# EasyEDA Pro project ProProject_【核心板】STC89C52RC最小系统_2024-04-21.epro, schematic Schematic1
Create Date: 2024-04-10; Page Name: P1; Project Name: 【核心板】STC89C52RC最小系统; Schematic Name: Schematic1; Update Date: 2024-04-20
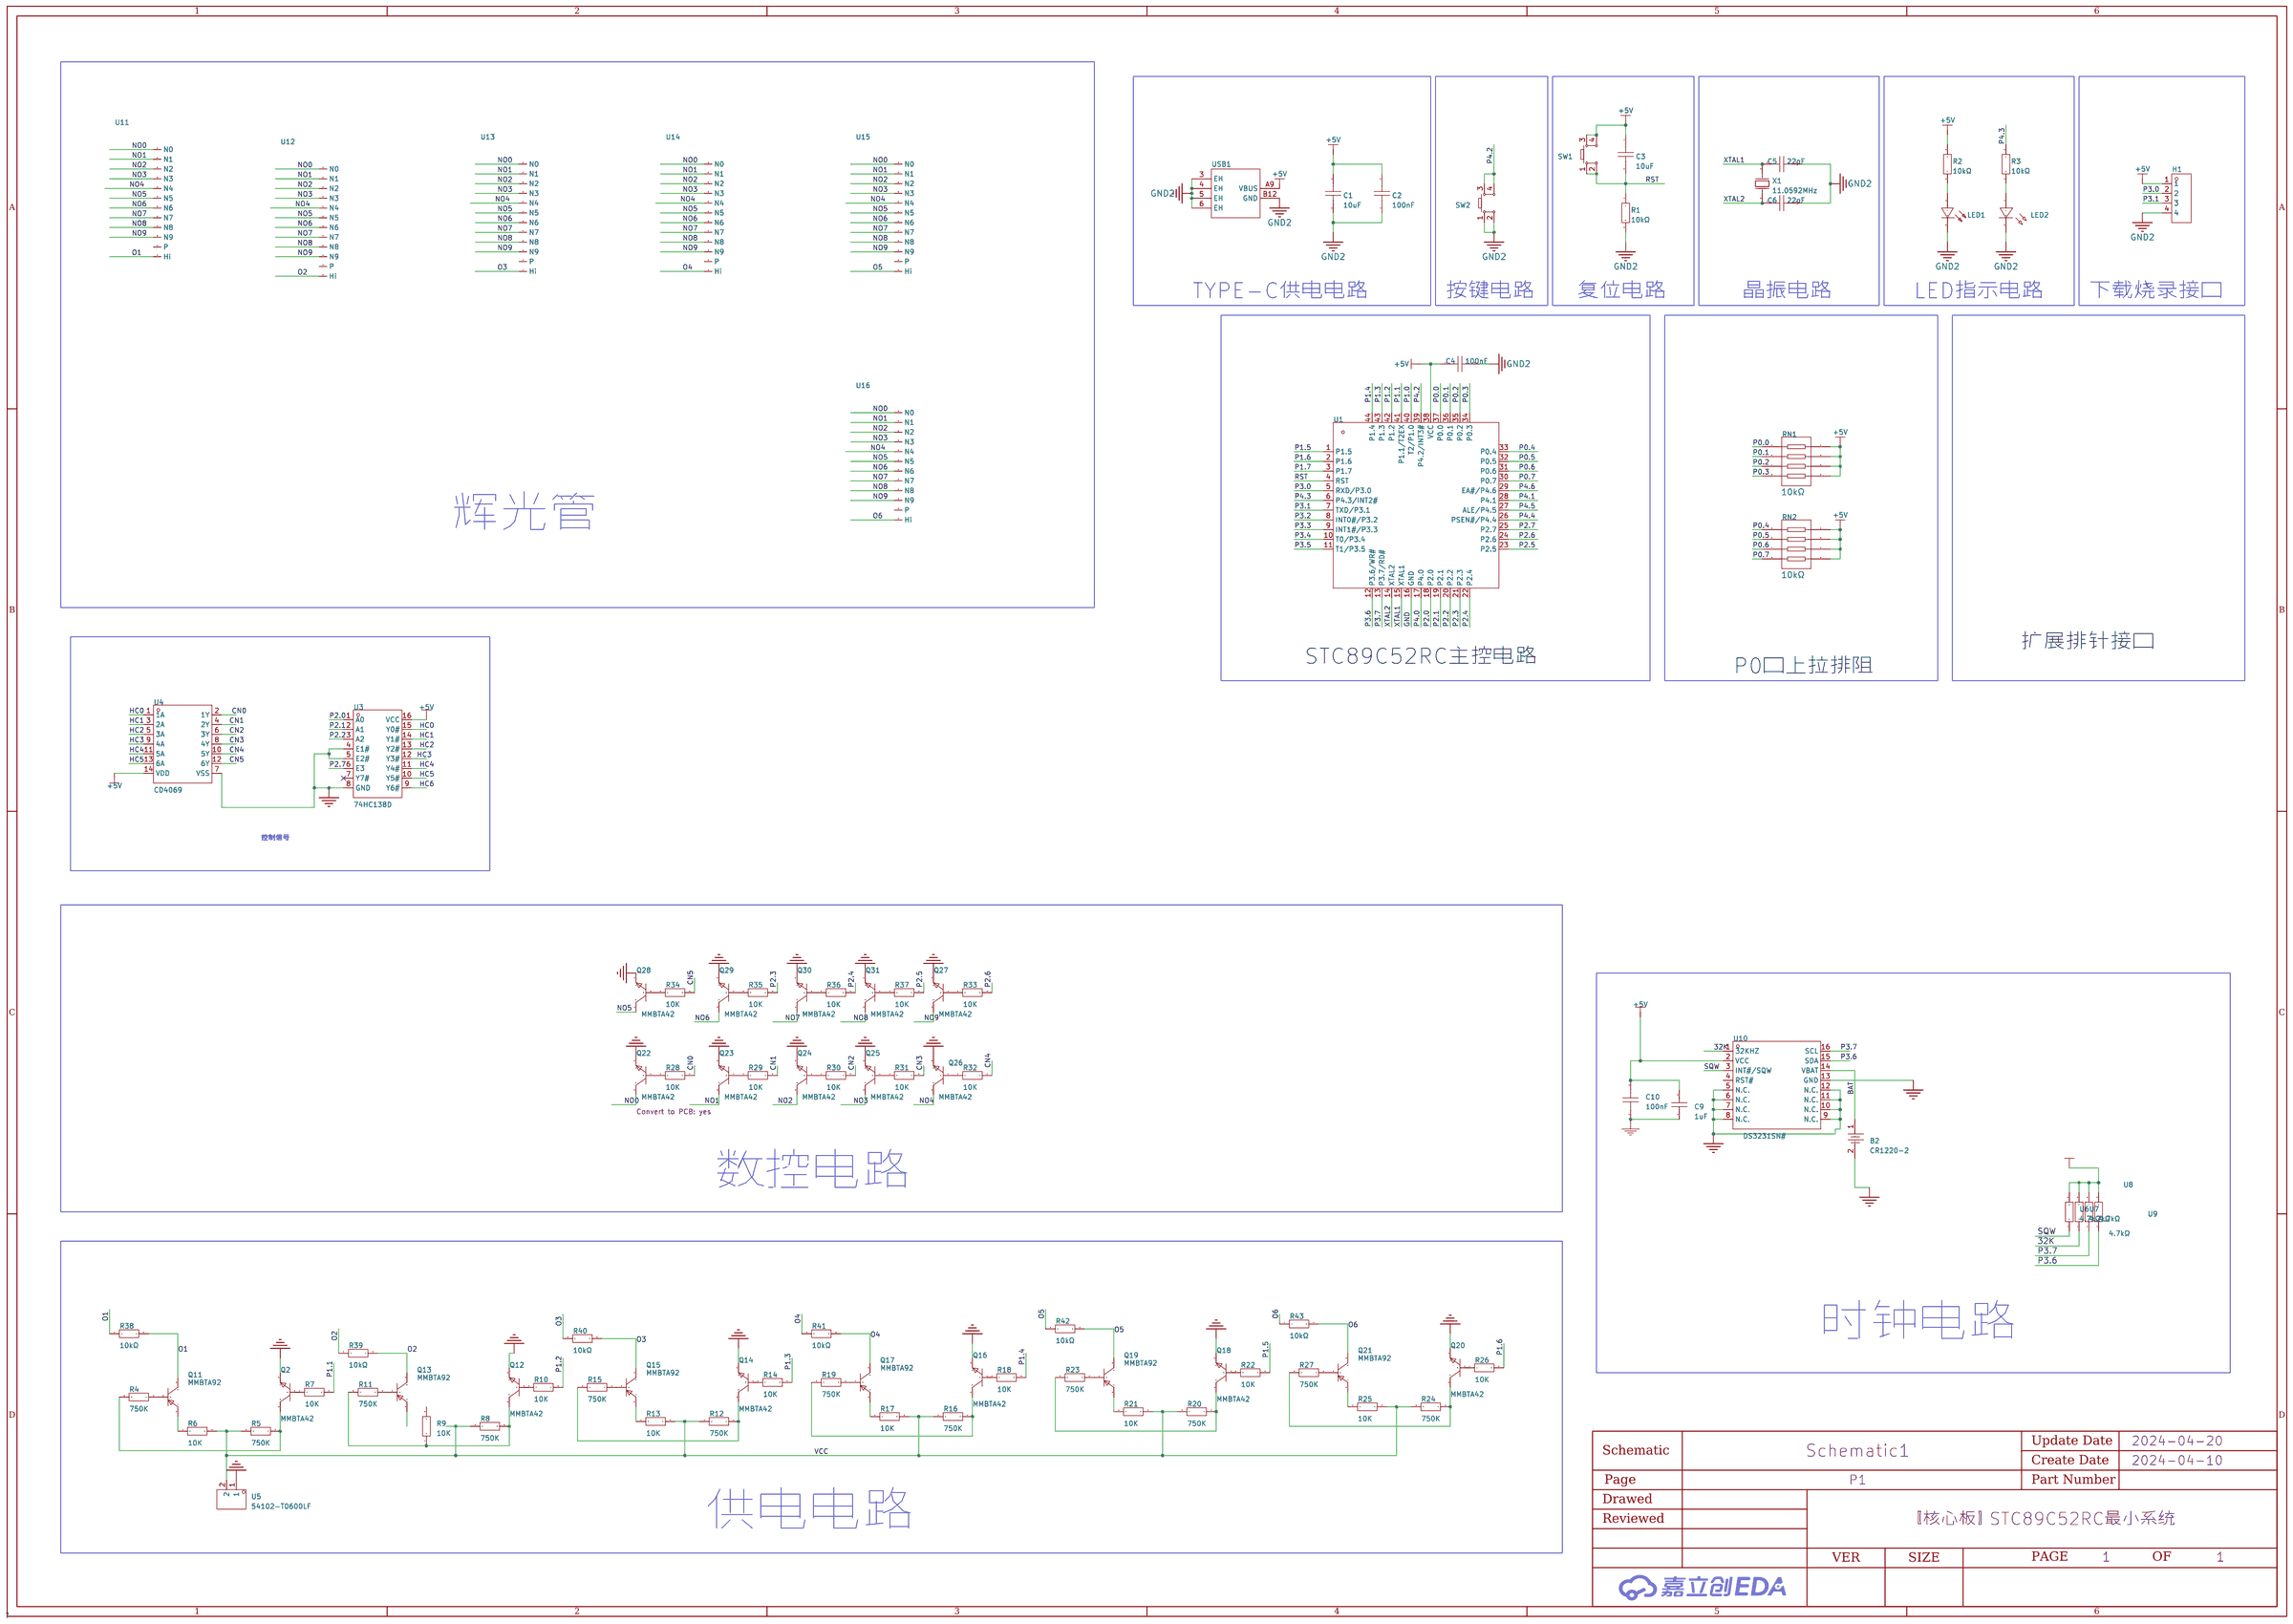
[diagram p0: schematic sheet]

## Parts
B2  CR1220-2  [BAT-SMD_CR1220-2]
C1  10uF  [C0603]
C2  100nF  [C0603]
C3  10uF  [C0603]
C4  100nF  [C0603]
C5  22pF  [C0603]
C6  22pF  [C0603]
C9  1uF  [C0603]
C10  100nF  [C0603]
H1  DZ254W-11-04-65  [HDR-TH_4P-P2.54-H-M-W10.3]
LED1  19-217/R6C-AL1M2VY/3T  [LED0603-R-RD]
LED2  -  [LED0603-RD_BLUE]
Q2  MMBTA42  [SOT-23-3_L2.9-W1.3-P1.90-LS2.4-BR]
Q11  MMBTA92  [SOT-23-3_L2.9-W1.3-P1.90-LS2.4-BR]
Q12  MMBTA42  [SOT-23-3_L2.9-W1.3-P1.90-LS2.4-BR]
Q13  MMBTA92  [SOT-23-3_L2.9-W1.3-P1.90-LS2.4-BR]
Q14  MMBTA42  [SOT-23-3_L2.9-W1.3-P1.90-LS2.4-BR]
Q15  MMBTA92  [SOT-23-3_L2.9-W1.3-P1.90-LS2.4-BR]
Q16  MMBTA42  [SOT-23-3_L2.9-W1.3-P1.90-LS2.4-BR]
Q17  MMBTA92  [SOT-23-3_L2.9-W1.3-P1.90-LS2.4-BR]
Q18  MMBTA42  [SOT-23-3_L2.9-W1.3-P1.90-LS2.4-BR]
Q19  MMBTA92  [SOT-23-3_L2.9-W1.3-P1.90-LS2.4-BR]
Q20  MMBTA42  [SOT-23-3_L2.9-W1.3-P1.90-LS2.4-BR]
Q21  MMBTA92  [SOT-23-3_L2.9-W1.3-P1.90-LS2.4-BR]
Q22  MMBTA42  [SOT-23-3_L2.9-W1.3-P1.90-LS2.4-BR]
Q23  MMBTA42  [SOT-23-3_L2.9-W1.3-P1.90-LS2.4-BR]
Q24  MMBTA42  [SOT-23-3_L2.9-W1.3-P1.90-LS2.4-BR]
Q25  MMBTA42  [SOT-23-3_L2.9-W1.3-P1.90-LS2.4-BR]
Q26  MMBTA42  [SOT-23-3_L2.9-W1.3-P1.90-LS2.4-BR]
Q27  MMBTA42  [SOT-23-3_L2.9-W1.3-P1.90-LS2.4-BR]
Q28  MMBTA42  [SOT-23-3_L2.9-W1.3-P1.90-LS2.4-BR]
Q29  MMBTA42  [SOT-23-3_L2.9-W1.3-P1.90-LS2.4-BR]
Q30  MMBTA42  [SOT-23-3_L2.9-W1.3-P1.90-LS2.4-BR]
Q31  MMBTA42  [SOT-23-3_L2.9-W1.3-P1.90-LS2.4-BR]
R1  10kΩ  [R0603]
R2  10kΩ  [R0603]
R3  10kΩ  [R0603]
R4  750K  [R0603]
R5  750K  [R0603]
R6  10K  [R0603]
R7  10K  [R0603]
R8  750K  [R0603]
R9  10K  [R0603]
R10  10K  [R0603]
R11  750K  [R0603]
R12  750K  [R0603]
R13  10K  [R0603]
R14  10K  [R0603]
R15  750K  [R0603]
R16  750K  [R0603]
R17  10K  [R0603]
R18  10K  [R0603]
R19  750K  [R0603]
R20  750K  [R0603]
R21  10K  [R0603]
R22  10K  [R0603]
R23  750K  [R0603]
R24  750K  [R0603]
R25  10K  [R0603]
R26  10K  [R0603]
R27  750K  [R0603]
R28  10K  [R0603]
R29  10K  [R0603]
R30  10K  [R0603]
R31  10K  [R0603]
R32  10K  [R0603]
R33  10K  [R0603]
R34  10K  [R0603]
R35  10K  [R0603]
R36  10K  [R0603]
R37  10K  [R0603]
R38  10kΩ  [R0603]
R39  10kΩ  [R0603]
R40  10kΩ  [R0603]
R41  10kΩ  [R0603]
R42  10kΩ  [R0603]
R43  10kΩ  [R0603]
RN1  10kΩ  [res-array-smd_0603-8p-l3.2-w1.6-bl]
RN2  10kΩ  [res-array-smd_0603-8p-l3.2-w1.6-bl]
SW1  PTS815SJK250SMTRLFS  [SW-SMD_4P-L4.2-W3.3-P2.15-LS5.1]
SW2  PTS815SJK250SMTRLFS  [SW-SMD_4P-L4.2-W3.3-P2.15-LS5.1]
U1  STC89C52RC-40I  [LQFP-44_L10.0-W10.0-P0.80-LS12.0-BL]
U3  74HC138D  [SOIC-16_L9.9-W3.9-P1.27-LS6.0-BL]
U4  CD4069  [SOP-14_L8.8-W3.9-P1.27-LS6.0-BL]
U5  54102-T0600LF  [HDR-TH_2P-P2.54-V-M-R2-C1-S2.54]
U6  4.7kΩ  [R0603]
U7  4.7kΩ  [R0603]
U8  4.7kΩ  [R0603]
U9  4.7kΩ  [R0603]
U10  DS3231SN#  [SOIC-16_L10.3-W7.5-P1.27-LS10.3-BL]
U11  -  [IN-12]
U12  -  [IN-12]
U13  -  [IN-12]
U14  -  [IN-12]
U15  -  [IN-12]
U16  -  [IN-12]
USB1  TYPE-C-31-M-33  [USB-C-TH_TYPE-C-31-M-33]
X1  11.0592MHz  [HC-49US_L11.5-W4.5-P4.88]

## Library data of the parts
B2 = CR1220-2: 连接器类型:电池底座;适用电池规格:CR1220;工作温度范围:-;; LCSC Part Name: 电池底座 适用电池:CR1220; Supplier Part: C70381; Manufacturer: Q&J; Supplier Footprint: SMD; JLCPCB Part Class: 扩展库; Datasheet: https://atta.szlcsc.com/upload/public/pdf/source/20160427/1461725216696.pdf; Supplier: LCSC; Connector Type: 电池底座; Battery Type: CR1220
C1 C3 = CL10A106MP8NNNC: 温度系数:X5R;精度:±20%;额定电压:10V;容值:10uF;; LCSC Part Name: 10uF(106) ±20% 10V; Supplier Part: C85713; Manufacturer: SAMSUNG(三星); Supplier Footprint: 0603; JLCPCB Part Class: 扩展库; Datasheet: https://atta.szlcsc.com/upload/public/pdf/source/20161027/1477535406017.pdf; Supplier: LCSC; Temperature Coefficient: X5R; Tolerance: ±20%; Voltage Rated: 10V
C2 C4 = CL10B104KB8NNNC: 容值:100nF;精度:±10%;额定电压:50V;材质(温度系数):X7R;; LCSC Part Name: 100nF ±10% 50V; Supplier Part: C1591; Manufacturer: SAMSUNG(三星); Supplier Footprint: 0603; JLCPCB Part Class: 扩展库; Datasheet: https://atta.szlcsc.com/upload/public/pdf/source/20160103/1457707680512.pdf; Supplier: LCSC; Tolerance: ±10%; Voltage Rated: 50V; Temperature Coefficient: X7R
C5 C6 = 0603CG220J500NT: 容值:22pF;精度:±5%;额定电压:50V;温度系数:C0G;; LCSC Part Name: 22pF ±5% 50V; Supplier Part: C91701; Manufacturer: FH(风华); Supplier Footprint: 0603; JLCPCB Part Class: 扩展库; Datasheet: https://atta.szlcsc.com/upload/public/pdf/source/20170923/C91701_1506149567492988977.pdf; Supplier: LCSC; Tolerance: ±5%; Voltage Rated: 50V; Temperature Coefficient: C0G
C9 = CL10A105KB8NNNC: 容值:1uF;精度:±10%;额定电压:50V;材质(温度系数):X5R;; LCSC Part Name: 1uF ±10% 50V; Supplier Part: C15849; Manufacturer: SAMSUNG(三星); Supplier Footprint: 0603; JLCPCB Part Class: 基础库; Datasheet: https://atta.szlcsc.com/upload/public/pdf/source/20160218/1457707763339.pdf; Supplier: LCSC; Tolerance: ±10%; Voltage Rated: 50V; Temperature Coefficient: X5R
C10 = CC0603KRX7R9BB104: 容值:100nF;精度:±10%;额定电压:50V;材质(温度系数):X7R;; LCSC Part Name: 100nF ±10% 50V; Supplier Part: C14663; Manufacturer: YAGEO(国巨); Supplier Footprint: 0603; JLCPCB Part Class: 基础库; Datasheet: https://atta.szlcsc.com/upload/public/pdf/source/20180910/C282072_33301C7F631E79921B82A8DAC6BCC5B3.pdf; Supplier: LCSC; Tolerance: ±10%; Voltage Rated: 50V; Temperature Coefficient: X7R
H1 = DZ254W-11-04-65: 间距:2.54mm;总PIN位数:4;排数:1;插针结构:1x4P;行距:-;安装类型:弯插;圆针/方针:方针;额定电流:3A;额定电压:-;配合针长度:6mm;塑高:2.54mm;端接针长度:-;工作温度范围:-;颜色:-;; LCSC Part Name: 2.54mm 1x4P 弯插 方针; Supplier Part: C2935929; Manufacturer: DEALON(德艺隆); Supplier Footprint: 弯插,P=2.54mm; JLCPCB Part Class: 扩展库; Datasheet: https://atta.szlcsc.com/upload/public/pdf/source/20211231/CEC96EEC99F3217E207F74B399519373.pdf; Supplier: LCSC; Pitch: 2.54mm; Number of Pins: 4; Number of Rows: 1; Pin Structure: 1x4P; Mounting Type: 弯插; Circluar Pins/Square Pins: 方针; Current Rating (Max): 3A; Length of Mating Pin: 6mm; Insulation Height: 2.54mm
LED1 = 19-217/R6C-AL1M2VY/3T: 发光颜色:红灯;二极管配置:-;透镜颜色:无色透明;主波长:617.5nm;峰值波长:632nm;色温:-;光通量(25时):-;测试电流:5mA;正向电压(VF):2.2V;发光强度:28.5mcd;功率:60mW;发光角度:120°;安装方式:-;工作温度:-40~+85;; LCSC Part Name: 红灯; Supplier Part: C72044; Manufacturer: EVERLIGHT(亿光); Supplier Footprint: 0603; JLCPCB Part Class: 扩展库; Datasheet: https://atta.szlcsc.com/upload/public/pdf/source/20160507/1462613613821.pdf; Supplier: LCSC; Emitted Color: 红灯; Lens Color: 无色透明; Dominant Wavelength: 617.5nm; Peak Wavelength: 632nm; Forward Current: 5mA; Forward Voltage (VF): 2.2V; Luminous Intensity: 28.5mcd; Power Dissipation: 60mW; Viewing Angle: 120°; Operating Temperature: -40~+85
LED2 = LED_0603-B: 照明颜色:蓝色;主波长/色坐标:465~475nm;; Supplier Footprint: 0603; Supplier Part: C72041; JLCPCB Part Class: 基础库; Supplier: LCSC; Manufacturer Part: 19-217/BHC-ZL1M2RY/3T; Manufacturer: EVERLIGHT(亿光)
Q2 Q12 Q14 Q16 Q18 Q20 Q22-Q31 = MMBTA42_C916394: 晶体管类型:-;集电极电流(Ic):500mA;集射极击穿电压(Vceo):200V;功率(Pd):350mW;直流电流增益(hFE@Ic,Vce):25@10A,1V;; LCSC Part Name: 电流:500mA 耐压:200V; Supplier Part: C916394; Manufacturer: JSMSEMI(杰盛微); Supplier Footprint: SOT-23; JLCPCB Part Class: 扩展库; Datasheet: https://atta.szlcsc.com/upload/public/pdf/source/20230807/6B12CD8957EFD553393B986F28AE3530.pdf; Supplier: LCSC; Collector Current (Ic): 500mA; Collector-Emitter Breakdown Voltage (Vceo): 200V; Power Dissipation (Pd): 350mW; DC Current Gain (hFE@Ic,Vce): 25@10A,1V; Transition Frequency (fT): 50MHz; Collector Cut-Off Current (Icbo): 100nA; Collector-Emitter Saturation Voltage (VCE(sat)@Ic,Ib): 500mV@20mA,2mA; Operating Temperature: -55℃~+150℃@(Tj)
Q11 Q13 Q15 Q17 Q19 Q21 = MMBTA92_C916395: 晶体管类型:-;集电极电流(Ic):500mA;集射极击穿电压(Vceo):300V;功率(Pd):250mW;直流电流增益(hFE@Ic,Vce):80@30mA,10V;; LCSC Part Name: 电流:500mA 耐压:300V; Supplier Part: C916395; Manufacturer: JSMSEMI(杰盛微); Supplier Footprint: SOT-23; JLCPCB Part Class: 扩展库; Datasheet: https://atta.szlcsc.com/upload/public/pdf/source/20230807/76A2B1BD349F049F8FE829441FC748A4.pdf; Supplier: LCSC; Collector Current (Ic): 500mA; Collector-Emitter Breakdown Voltage (Vceo): 300V; Power Dissipation (Pd): 250mW; DC Current Gain (hFE@Ic,Vce): 80@30mA,10V; Transition Frequency (fT): 50MHz; Collector Cut-Off Current (Icbo): 100nA; Collector-Emitter Saturation Voltage (VCE(sat)@Ic,Ib): 500mV@20mA,2mA; Operating Temperature: -55℃~+150℃@(Tj)
R1-R3 = RC0603JR-0710KL: 最大工作电压:75V;阻值:10kΩ;电阻长:-;精度:±5%;电阻直径:-;电阻高:-;电阻宽:-;电阻类型:厚膜电阻;温度系数:±100ppm/;工作温度范围:-55~+125;功率:100mW;; LCSC Part Name: 10kΩ ±5%; Supplier Part: C99198; Manufacturer: YAGEO(国巨); Supplier Footprint: 0603; JLCPCB Part Class: 扩展库; Datasheet: https://atta.szlcsc.com/upload/public/pdf/source/20181223/C99198_917934A193F41F77D9F7D214A8C79116.pdf; Supplier: LCSC; Overload Voltage (Max): 75V; Tolerance: ±5%; Type: 厚膜电阻; Temperature Coefficient: ±100ppm/; Operating Temperature Range: -55~+125; Power(Watts): 100mW
R4-R37 = Res_0603: Supplier Footprint: 0603
R38-R43 = 0603WAF1002T5E: 电阻类型:厚膜电阻;阻值:10kΩ;精度:±1%;功率:100mW;最大工作电压:75V;温度系数:±100ppm/℃;; LCSC Part Name: 厚膜电阻 10kΩ ±1% 100mW; Supplier Part: C25804; Manufacturer: UNI-ROYAL(厚声); Supplier Footprint: 0603; JLCPCB Part Class: 基础库; Datasheet: https://atta.szlcsc.com/upload/public/pdf/source/20200306/C422600_1E6D84923E4A46A82E41ADD87F860B5C.pdf; Supplier: LCSC; Type: 厚膜电阻; Tolerance: ±1%; Power(Watts): 100mW; Overload Voltage (Max): 75V; Temperature Coefficient: ±100ppm/℃; Operating Temperature Range: -55℃~+155℃
RN1 RN2 = yc164-jr-0710kl: 阻值:10kΩ;精度:±5%;单个元件功率:62.5mW;温度系数:±200ppm/;电阻器数:4;引脚数:8;; LCSC Part Name: 10kΩ ±5% 0603x4; Supplier Part: C107374; Manufacturer: YAGEO(国巨); Manufacturer Part: YC164-JR-0710KL; Supplier Footprint: 1206; JLCPCB Part Class: 扩展库; Datasheet: https://atta.szlcsc.com/upload/public/pdf/source/20170418/1492506324305.pdf; Supplier: LCSC; Tolerance: ±5%; Power(Watts): 62.5mW; Temperature Coefficient: ±200ppm/; Number of Resistors: 4; Number of Pins: 8
SW1 SW2 = PTS815SJK250SMTRLFS: 操作寿命10万次，使用温度-20°C 至 70°C,尺寸4.20mmx3.20mmx2.50mm，操作力度2.5N; LCSC Part Name: 轻触开关; Supplier Part: C918859; Manufacturer: C&K; Supplier Footprint: SMD; JLCPCB Part Class: 扩展库; Datasheet: https://atta.szlcsc.com/upload/public/pdf/source/20190916/C411883_4F77F16E1D8E48DC707D8949CEE7CF80.pdf; Supplier: LCSC
U1 = STC89C52RC-40I: 工作电压:3.3V ~ 5.5V;CPU内核:8051;主频（MAX):80MHz;; Supplier Part: C8707; Manufacturer: STC(宏晶); Supplier Footprint: LQFP-44_10x10x08P; JLCPCB Part Class: 扩展库; Datasheet: https://atta.szlcsc.com/upload/public/pdf/source/20120807/1457706521177.pdf; Supplier: LCSC; Voltage - Supply (Vcc/Vdd): 3.3V ~ 5.5V; EEPROM Size: 4KB; Core Processor: 8051; Program Memory Size: 8KB; RAM Size: 512Bytes; Speed: 80MHz; Number of I/O: 39
U3 = 74HC138D_C5205140: 供电电压:2V~6V;线路数:-;灌电流(IOL):-;拉电流(IOH):-;; LCSC Part Name: 3-8路解码器; Supplier Part: C5205140; Manufacturer: JSMSEMI(杰盛微); Supplier Footprint: SOP-16; JLCPCB Part Class: 扩展库; Datasheet: https://atta.szlcsc.com/upload/public/pdf/source/20240105/D072A69099C5C9DD6538126D38A11070.pdf; Supplier: LCSC; Voltage Supply Source: 单电源; Supply Voltage: 2V~6V; Operating temperature: -40℃~+125℃
U4 = CD4069_C3041279: Supplier Part: C3041279; Manufacturer: Slkor(萨科微); Supplier Footprint: SOP-14; JLCPCB Part Class: Extended Part; Datasheet: https://atta.szlcsc.com/upload/public/pdf/source/20220623/6C37EC87FC284946A42A9DB2DCC3C47C.pdf; Supplier: LCSC
U5 = 54102-T0600LF: 插针结构:-;间距:2.54mm;行距:2.54mm;圆针/方针:-;安装类型:直插;排数:双排;额定电流:3A;额定电压:-;配合针长度:-;塑高:2.54mm;触头材质:磷青铜;触头镀层:锡;工作温度范围:-65℃~+125℃;颜色:黑色;; LCSC Part Name: 间距:2.54mm 直插 双排针，价格为单根针，包装为圆盘; Supplier Part: C213465; Manufacturer: Amphenol; Supplier Footprint: 插件,P=2.54mm; JLCPCB Part Class: 扩展库; Datasheet: https://atta.szlcsc.com/upload/public/pdf/source/20180704/C213183_6F36A8F659D914F6844A0A706A419C5D.pdf; Supplier: LCSC; Pitch: 2.54mm; Row Spacing: 2.54mm; Mounting Type: 直插; Number of Rows: 双排; Current Rating (Max): 3A; Insulation Height: 2.54mm; Contact Material: 磷青铜; Contact Plating: 锡; Operating Temperature Range: -65℃~+125℃; Color: 黑色
U6-U9 = AR03FTDX4701A: 电阻类型:薄膜电阻;阻值:4.7kΩ;精度:±1%;功率:100mW;最大工作电压:75V;温度系数:±50ppm/℃;; LCSC Part Name: 薄膜电阻 4.7kΩ ±1% 100mW; Supplier Part: C2924150; Manufacturer: Viking(光颉); Supplier Footprint: 0603; JLCPCB Part Class: 扩展库; Datasheet: https://atta.szlcsc.com/upload/public/pdf/source/20211123/7AFDB03DAF68AA91648A852AAE26A3AB.pdf; Supplier: LCSC; Type: 薄膜电阻; Tolerance: ±1%; Power(Watts): 100mW; Overload Voltage (Max): 75V; Temperature Coefficient: ±50ppm/℃; Operating Temperature Range: -55℃~+155℃
U10 = DS3231SN#: 接口:I2C;; Supplier Part: C722469; Manufacturer: ADI(亚德诺)/MAXIM(美信); Supplier Footprint: SOIC-16-300mil; JLCPCB Part Class: 扩展库; Datasheet: https://atta.szlcsc.com/upload/public/pdf/source/20170713/C118524_1499918908819816807.pdf; Supplier: LCSC; Interface: I2C; Operating Voltage: 2.3V~5.5V; Operating Temperature: -40℃~+85℃
U11-U16 = IN-12A
USB1 = TYPE-C-31-M-33: 连接器类型:Type-C;标准:-;公母:母座;触点数量:2;端口数量:1;安装方式:弯插;额定电流 - 电源:3A;工作温度范围:-30~+80;; LCSC Part Name: Type-C 母座 弯插; Supplier Part: C2848624; Manufacturer: 韩国韩荣; Supplier Footprint: 插件; JLCPCB Part Class: 扩展库; Datasheet: https://atta.szlcsc.com/upload/public/pdf/source/20210810/4286DADA658895E6A7755A4FC585FBE4.pdf; Supplier: LCSC; Connector Type: Type-C; Gender: 母座; Number of Contacts: 2; Number of Ports: 1; Mounting Style: 弯插; Current Rating - Power (Max): 3A; Operating Temperature Range: -30~+80
X1 = B11059J019: 晶振类型:49S晶振;频率:11.0592MHz;频率公差:±20ppm;频率稳定度:-;负载电容:20pF;工作温度:-20~+70;; LCSC Part Name: 11.0592MHz ±20ppm 20pF; Supplier Part: C258977; Manufacturer: ECEC(东晶); Supplier Footprint: HC-49S; JLCPCB Part Class: 扩展库; Datasheet: https://atta.szlcsc.com/upload/public/pdf/source/20180726/C258977_536F34D63223CD2FFDE36214EBB8511D.pdf; Supplier: LCSC; Crystal Type: 49S晶振; Frequency Tolerance: ±20ppm; Load Capacitance: 20pF; Operating Temperature: -20~+70

## Nets
+5V: C1.1 C2.2 C3.1 C4.1 C9.2 C10.2 H1.1 R2.1 RN1.1 RN1.2 RN1.3 RN1.4 RN2.1 RN2.2 RN2.3 RN2.4 SW1.3 SW1.4 U1.38(VCC) U3.16(VCC) U4.14(VDD) U6.2 U7.2 U8.2 U9.2 U10.2(VCC) USB1.A9(VBUS)
GND: U1.16(GND) U5.1
GND1: Q2.2(E) Q12.2(E) Q14.2(E) Q16.2(E) Q18.2(E) Q20.2(E) Q22.2(E) Q23.2(E) Q24.2(E) Q25.2(E) Q26.2(E) Q27.2(E) Q28.2(E) Q29.2(E) Q30.2(E) Q31.2(E)
GND2: B2.2 C1.2 C2.1 C4.2 C5.2 C6.2 C9.1 C10.1 H1.4 LED1.2(C) LED2.2(C) R1.2 SW2.1 SW2.2 U3.4(E1#) U3.5(E2#) U3.8(GND) U4.7(VSS) U10.5(N.C.) U10.6(N.C.) U10.7(N.C.) U10.8(N.C.) U10.9(N.C.) U10.10(N.C.) U10.11(N.C.) U10.12(N.C.) U10.13(GND) USB1.3(EH) USB1.4(EH) USB1.5(EH) USB1.6(EH) USB1.B12(GND)
VCC: R5.2 R6.2 R8.2 R12.2 R13.2 R16.2 R17.2 R20.2 R21.2 R24.2 R25.2 U5.2
32K: U7.1 U10.1(32KHZ)
BAT: B2.1 U10.14(VBAT)
CN0: R28.2 U4.2(1Y)
CN1: R29.2 U4.4(2Y)
CN2: R30.2 U4.6(3Y)
CN3: R31.2 U4.8(4Y)
CN4: R32.2 U4.10(5Y)
CN5: R34.2 U4.12(6Y)
HC0: U3.15(Y0#) U4.1(1A)
HC1: U3.14(Y1#) U4.3(2A)
HC2: U3.13(Y2#) U4.5(3A)
HC3: U3.12(Y3#) U4.9(4A)
HC4: U3.11(Y4#) U4.11(5A)
HC5: U3.10(Y5#) U4.13(6A)
HC6: U3.9(Y6#)
NO0: Q22.3(C) U11.N0 U12.N0 U13.N0 U14.N0 U15.N0 U16.N0
NO1: Q23.3(C) U11.N1 U12.N1 U13.N1 U14.N1 U15.N1 U16.N1
NO2: Q24.3(C) U11.N2 U12.N2 U13.N2 U14.N2 U15.N2 U16.N2
NO3: Q25.3(C) U11.N3 U12.N3 U13.N3 U14.N3 U15.N3 U16.N3
NO4: Q26.3(C) U11.N4 U12.N4 U13.N4 U14.N4 U15.N4 U16.N4
NO5: Q28.3(C) U11.N5 U12.N5 U13.N5 U14.N5 U15.N5 U16.N5
NO6: Q29.3(C) U11.N6 U12.N6 U13.N6 U14.N6 U15.N6 U16.N6
NO7: Q30.3(C) U11.N7 U12.N7 U13.N7 U14.N7 U15.N7 U16.N7
NO8: Q31.3(C) U11.N8 U12.N8 U13.N8 U14.N8 U15.N8 U16.N8
NO9: Q27.3(C) U11.N9 U12.N9 U13.N9 U14.N9 U15.N9 U16.N9
O1: Q11.3(C) R38.1 R38.2 U11.Hi
O2: Q13.3(C) R39.1 R39.2 U12.Hi
O3: Q15.3(C) R40.1 R40.2 U13.Hi
O4: Q17.3(C) R41.1 R41.2 U14.Hi
O5: Q19.3(C) R42.1 R42.2 U15.Hi
O6: Q21.3(C) R43.1 R43.2 U16.Hi
P0.0: RN1.5 U1.37(P0.0)
P0.1: RN1.6 U1.36(P0.1)
P0.2: RN1.7 U1.35(P0.2)
P0.3: RN1.8 U1.34(P0.3)
P0.4: RN2.5 U1.33(P0.4)
P0.5: RN2.6 U1.32(P0.5)
P0.6: RN2.7 U1.31(P0.6)
P0.7: RN2.8 U1.30(P0.7)
P1.0: U1.40(T2/P1.0)
P1.1: R7.2 U1.41(P1.1/T2EX)
P1.2: R10.2 U1.42(P1.2)
P1.3: R14.2 U1.43(P1.3)
P1.4: R18.2 U1.44(P1.4)
P1.5: R22.2 U1.1(P1.5)
P1.6: R26.2 U1.2(P1.6)
P1.7: U1.3(P1.7)
P2.0: U1.18(P2.0) U3.1(A0)
P2.1: U1.19(P2.1) U3.2(A1)
P2.2: U1.20(P2.2) U3.3(A2)
P2.3: R35.2 U1.21(P2.3)
P2.4: R36.2 U1.22(P2.4)
P2.5: R37.2 U1.23(P2.5)
P2.6: R33.2 U1.24(P2.6)
P2.7: U1.25(P2.7) U3.6(E3)
P3.0: H1.2 U1.5(RXD/P3.0)
P3.1: H1.3 U1.7(TXD/P3.1)
P3.2: U1.8(INT0#/P3.2)
P3.3: U1.9(INT1#/P3.3)
P3.4: U1.10(T0/P3.4)
P3.5: U1.11(T1/P3.5)
P3.6: U1.12(P3.6/WR#) U9.1 U10.15(SDA)
P3.7: U1.13(P3.7/RD#) U8.1 U10.16(SCL)
P4.0: U1.17(P4.0)
P4.1: U1.28(P4.1)
P4.2: SW2.3 SW2.4 U1.39(P4.2/INT3#)
P4.3: R3.1 U1.6(P4.3/INT2#)
P4.4: U1.26(PSEN#/P4.4)
P4.5: U1.27(ALE/P4.5)
P4.6: U1.29(EA#/P4.6)
RST: C3.2 R1.1 SW1.1 SW1.2 U1.4(RST)
SQW: U6.1 U10.3(INT#/SQW)
XTAL1: C5.1 U1.15(XTAL1) X1.2(OSC2)
XTAL2: C6.1 U1.14(XTAL2) X1.1(OSC1)
$1N1351: LED1.1(A) R2.2
$1N1355: LED2.1(A) R3.2
$1N2619: Q11.2(E) R6.1
$1N2621: Q2.1(B) R7.1
$1N2624: Q2.3(C) R4.2 R5.1
$1N2625: Q11.1(B) R4.1
$1N3050: Q12.1(B) R10.1
$1N3053: Q13.1(B) R11.1
$1N3261: Q15.2(E) R13.1
$1N3263: Q14.1(B) R14.1
$1N3265: Q14.3(C) R12.1 R15.2
$1N3266: Q15.1(B) R15.1
$1N3474: Q17.2(E) R17.1
$1N3476: Q16.1(B) R18.1
$1N3478: Q16.3(C) R16.1 R19.2
$1N3479: Q17.1(B) R19.1
$1N3687: Q19.2(E) R21.1
$1N3689: Q18.1(B) R22.1
$1N3691: Q18.3(C) R20.1 R23.2
$1N3692: Q19.1(B) R23.1
$1N3900: Q21.2(E) R25.1
$1N3902: Q20.1(B) R26.1
$1N3904: Q20.3(C) R24.1 R27.2
$1N3905: Q21.1(B) R27.1
$1N4218: Q22.1(B) R28.1
$1N4332: Q23.1(B) R29.1
$1N4415: Q24.1(B) R30.1
$1N4498: Q25.1(B) R31.1
$1N4581: Q26.1(B) R32.1
$1N4664: Q27.1(B) R33.1
$1N4747: Q28.1(B) R34.1
$1N4830: Q29.1(B) R35.1
$1N4913: Q30.1(B) R36.1
$1N4996: Q31.1(B) R37.1
Net-(Q12-3): Q12.3(C) R8.1 R9.1 R11.2

Not connected (* = marked no-connect by the designer): Q13 2(E); R9 2; U3 7(Y7#)*; U10 4(RST#); U11 P; U12 P; U13 P; U14 P; U15 P; U16 P

## Notes on the sheet
- TYPE-C供电电路
- 按键电路
- 复位电路
- 晶振电路
- LED指示电路
- 下载烧录接口
- 辉光管
- 扩展排针接口
- STC89C52RC主控电路
- P0口上拉排阻
- 控制信号
- 数控电路
- 时钟电路
- 供电电路
